# Altium schematic sheet Mobile_device_sheet4_sensor.SchDoc
size A4; SheetNumber: 3; SheetTotal: 5
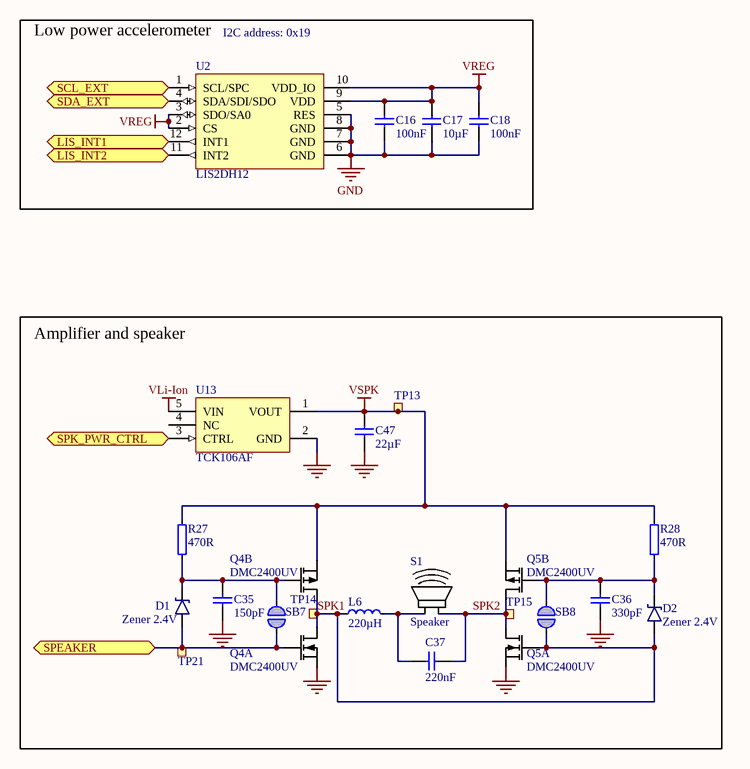
[diagram p0: Mobile_device_sheet4_sensor.SchDoc]

## Parts
C16  100nF  [CAPC1005X04L]
C17  10µF  [CAPC1608X06L]
C18  100nF  [CAPC1005X04L]
C35  150pF  [CAPC1005X04L]
C36  330pF  [CAPC1005X04L]
C37  220nF  [CAPC1005X04L]
C47  22µF  [CAPC1608X06L]
D1  Zener 2.4V  [SOD-523]
D2  Zener 2.4V  [SOD-523]
L6  220µH  [INDP4040X25N]
Q4  DMC2400UV  [SOTFL50P162X60-6N]  (parts A,B of 2)
Q5  DMC2400UV  [SOTFL50P162X60-6N]  (parts A,B of 2)
R27  470R  [RESC1005X04L]
R28  470R  [RESC1005X04L]
S1  Speaker  [Speaker 15x11x3mm]  (no BOM)
SB7  Solderbridge  [Solderbridge]  (value not drawn)  (no BOM)
SB8  Solderbridge  [Solderbridge]  (value not drawn)  (no BOM)
TP13  Ø1.5mm,SMD  [TP_SMD_Ø1.5mm]  (value not drawn)  (no BOM)
TP14  Ø1.5mm,SMD  [TP_SMD_Ø1.5mm]  (value not drawn)  (no BOM)
TP15  Ø1.5mm,SMD  [TP_SMD_Ø1.5mm]  (value not drawn)  (no BOM)
TP21  Ø1.5mm,SMD  [TP_SMD_Ø1.5mm]  (value not drawn)  (no BOM)
U2  LIS2DH12  [LGA50P200X200X100-12N]
U13  TCK106AF  [SOT95P280X140-5N]

## Blocks framed on the sheet
Low power accelerometer: C16-C18 U2
Amplifier and speaker: C35-C37 C47 D1 D2 L6 Q4 Q5 R27 R28 S1 SB7 SB8 TP13-TP15 TP21 U13

## Ports
LIS_INT1 (bidir), LIS_INT2 (bidir), SCL_EXT (bidir), SDA_EXT (bidir), SPEAKER (bidir), SPK_PWR_CTRL (bidir)

## Nets
GND: C16.1 C17.1 C18.1 C35.1 C36.1 C47.1 Q4.1(S1) Q5.1(S1) U2.5(RES) U2.6(GND) U2.7(GND) U2.8(GND) U13.2(GND)
VLi-Ion: U13.5(VIN)
VREG: C16.2 C17.2 C18.2 U2.2(CS) U2.3(SDO/SA0) U2.9(VDD) U2.10(VDD_IO)
VSPK: C47.2 Q4.4(S2) Q5.4(S2) R27.1 R28.1 TP13.1 U13.1(VOUT)
LIS_INT1: U2.12(INT1) ; port LIS_INT1
LIS_INT2: U2.11(INT2) ; port LIS_INT2
SCL_EXT: U2.1(SCL/SPC) ; port SCL_EXT
SDA_EXT: U2.4(SDA/SDI/SDO) ; port SDA_EXT
SPEAKER: D1.1(A) Q4.2(G1) SB7.2 TP21.1 ; port SPEAKER
SPK1: D2.1(A) L6.1 Q4.3(D2) Q4.6(D1) Q5.2(G1) SB8.2 TP14.1
SPK2: C37.1 Q5.3(D2) Q5.6(D1) S1.2 TP15.1
SPK_PWR_CTRL: U13.3(CTRL) ; port SPK_PWR_CTRL
NetC35_2: C35.2 D1.3(C) Q4.5(G2) R27.2 SB7.1
NetC36_2: C36.2 D2.3(C) Q5.5(G2) R28.2 SB8.1
NetC37_2: C37.2 L6.2 S1.1

Not connected (* = marked no-connect by the designer): U13 4(NC)

## Notes on the sheet
- (near U2) I2C address: 0x19

## Library data of the parts
C16 C18 = C0402-100n: Capacitor, X7R, ±10%; Part number IPS: 00000005296; Note: 16V; Artikkelnr Noca: 20039200; Part Number: C0402-100n; Manufacturer: *; Manufacturer Part Number: *; Footprint Doc: 0402; LatestRevisionDate: 2009-11-23; Pin Count: 2; Publisher: Nordic Semiconductor; Published: 2009-05-08; Value: 100nF; ComponentLink1URL: *; ComponentLink1Description: Datasheet; ComponentLink2URL: *; ComponentLink2Description: Supplier link; HelpURL: *; Supplier 1: *; Supplier Part Number 1: *; Supplier 2: *; Supplier Part Number 2: *
C17 = C0603-10µ: Capacitor, X5R, ±20%; Part number IPS: 00000007785; Note: 6.3V; Artikkelnr Noca: 20039234; Part Number: C0603-10µ; Manufacturer: *; Manufacturer Part Number: *; Footprint Doc: 0603; LatestRevisionDate: 2011-01-17; Pin Count: 2; Publisher: Nordic Semiconductor; Published: 2011-01-17; Value: 10µF; ComponentLink1URL: *; ComponentLink1Description: Datasheet; ComponentLink2URL: *; ComponentLink2Description: Supplier link; HelpURL: *; Supplier 1: *; Supplier Part Number 1: *; Supplier 2: *; Supplier Part Number 2: *
C35 = C0402-150p: Capacitor, NP0, ±5%; Part number IPS: 00000007972; Note: 50V; Artikkelnr Noca: 20029111; Part Number: C0402-150p; Manufacturer: *; Manufacturer Part Number: *; Footprint Doc: 0402; LatestRevisionDate: 2009-05-08; Pin Count: 2; Publisher: Nordic Semiconductor; Published: 2009-05-08; Value: 150pF; ComponentLink1URL: *; ComponentLink1Description: Datasheet; ComponentLink2URL: *; ComponentLink2Description: Supplier link; HelpURL: *; Supplier 1: *; Supplier Part Number 1: *; Supplier 2: *; Supplier Part Number 2: *
C36 = C0402-330p: Capacitor, NP0, ±5%; Part number IPS: 00000006576; Note: 50V; Artikkelnr Noca: N.A.; Part Number: C0402-330p; Manufacturer: *; Manufacturer Part Number: *; Footprint Doc: 0402; LatestRevisionDate: 2017-02-02; Pin Count: 2; Publisher: Nordic Semiconductor; Published: 2009-05-08; Value: 330pF; ComponentLink1URL: *; ComponentLink1Description: Datasheet; ComponentLink2URL: *; ComponentLink2Description: Supplier link; HelpURL: *; Supplier 1: *; Supplier Part Number 1: *; Supplier 2: *; Supplier Part Number 2: *
C37 = C0402-220n: Capacitor, X7R, ±10%; Part number IPS: 00000006793; Note: 16V; Artikkelnr Noca: N.A.; Part Number: C0402-220n; Manufacturer: *; Manufacturer Part Number: *; Footprint Doc: 0402; LatestRevisionDate: 2009-05-08; Pin Count: 2; Publisher: Nordic Semiconductor; Published: 2009-05-08; Value: 220nF; ComponentLink1URL: *; ComponentLink1Description: Datasheet; ComponentLink2URL: *; ComponentLink2Description: Supplier link; HelpURL: *; Supplier 1: *; Supplier Part Number 1: *; Supplier 2: *; Supplier Part Number 2: *
C47 = C0603-22µ-6.3V: CAP CER 22UF 6.3V 20% X5R 0603; Manufacturer: Samsung; Manufacturer Part Number: CL10A226MQ8NRNC; Part number IPS: 00000007787; Artikkelnr Noca: N.A.; Part Number: C0603-22µ-6.3V; Footprint Doc: 0603; LatestRevisionDate: 2015-04-10; Pin Count: 2; Publisher: Nordic Semiconductor; Published: 2015-04-10; Value: 22µF; Note: 6.3V; ComponentLink1URL: *; ComponentLink1Description: Datasheet; ComponentLink2URL: *; ComponentLink2Description: Supplier link; HelpURL: http://www.samsungsem.com/kr/front/downloadcms.do?path=/kr/support/product-search/mlcc/__icsFiles/afieldfile/2014/11/05&fileName=S_CL10A226MQ8NRNC.pdf; Supplier 1: Digi-Key; Supplier Part Number 1: 1276-1193-1-ND; Supplier 2: *; Supplier Part Number 2: *
D1 D2 = BZT52C2V4T: Diode, Zener, 2.4V, 0.3W; Manufacturer: Diodes Incorporated; Part number IPS: 00000007974; Artikkelnr Noca: N.A.; Part Number: BZT52C2V4T; Manufacturer Part Number: BZT52C2V4T; Footprint Doc: SOD-523; LatestRevisionDate: 2017-01-25; Publisher: Nordic Semiconductor; Published: 2017-01-25; Value: Zener 2.4V; Note: *; Pin Count: 2; ComponentLink1URL: *; ComponentLink1Description: Datasheet; ComponentLink2URL: *; ComponentLink2Description: Supplier link; HelpURL: http://www.diodes.com/_files/datasheets/ds30502.pdf; Supplier 1: Digi-Key; Supplier Part Number 1: BZT52C2V4T-7DICT-ND; Supplier 2: *; Supplier Part Number 2: *
L6 = L4040-220µ: Inductor, ±20%, 200mA, 2.76 Ohm; Manufacturer: Bourns; Manufacturer Part Number: SRN4026-221M; Part number IPS: 00000007797; Note: -40°C ~ 125°C; Artikkelnr Noca: N:A; Part Number: L4040-220µ; Footprint Doc: 4040; LatestRevisionDate: 2016-01-18; Pin Count: 2; Publisher: Nordic Semiconductor; Published: 2016-01-18; Value: 220µH; ComponentLink1Description: Datasheet; ComponentLink2Description: Supplier link; ComponentLink1URL: *; ComponentLink2URL: *; HelpURL: http://www.bourns.com/docs/Product-Datasheets/SRN4026.pdf; Supplier 1: Digi-Key; Supplier Part Number 1: SRN4026-221MCT-ND; Supplier 2: *; Supplier Part Number 2: *
Q4 Q5 = DMC2400UV: Dual N & P Ch MOFET, 1.03A/0.7A, 480mOhm, 450mW; Manufacturer: Diodes Incorporated; Part number IPS: 00000007803; Note: Dual N & P Channel Digital FET; Artikkelnr Noca: N.A.; Part Number: DMC2400UV; Manufacturer Part Number: DMC2400UV; Footprint Doc: SOT-563; LatestRevisionDate: 2016-01-18; Pin Count: 6; Publisher: Nordic Semiconductor; Published: 2016-01-18; Value: DMC2400UV; ComponentLink1URL: *; ComponentLink1Description: Datasheet; ComponentLink2URL: *; ComponentLink2Description: Supplier link; HelpURL: http://www.diodes.com/_files/datasheets/DMC2400UV.pdf; Supplier 1: Digi-Key; Supplier Part Number 1: DMC2400UV-7DICT-ND; Supplier 2: *; Supplier Part Number 2: *
R27 R28 = R0402-470: Resistor, ±1%, 0.063W; Part number IPS: 00000007975; Note: Chip Res 1%; Artikkelnr Noca: 27049065; Part Number: R0402-470; Manufacturer: *; Manufacturer Part Number: *; LatestRevisionDate: 2009-11-23; Pin Count: 2; Publisher: Nordic Semiconductor; Published: 2009-05-08; Value: 470R; Footprint Doc: 0402; ComponentLink1URL: *; ComponentLink1Description: Datasheet; ComponentLink2URL: *; ComponentLink2Description: Supplier link; HelpURL: *; Supplier 1: Farnell; Supplier Part Number 1: 173-8845; Supplier 2: *; Supplier Part Number 2: *
S1 = BMS1511F-11C-08H03P LF: Speaker, SMD, 15.0mm x 11.0mm x 3.0mm, 0Hz-20kHz, 89dB, 8 ohm, 0.7W; Manufacturer: BeStar; Artikkelnr Noca: N.A.; Part Number: BMS1511F-11C-08H03P LF; Manufacturer Part Number: BMS1511F-11C-08H03P LF; Footprint Doc: Speaker 15x11x3mm; LatestRevisionDate: 2016-09-15; Pin Count: 2; Publisher: Nordic Semiconductor; Published: 2016-09-15; Value: Speaker; Note: *; Part number IPS: N.A.; ComponentLink1URL: *; ComponentLink1Description: Datasheet; ComponentLink2URL: *; ComponentLink2Description: Supplier link; HelpURL: \\hizz\pro\app9717\Datasheet\speakers\bestar\BMS1511F-11C-08H03P LF.pdf; Supplier 1: *; Supplier Part Number 1: *; Supplier 2: *; Supplier Part Number 2: *
SB7 SB8 = Solderbridge: Artikkelnr Noca: N.A.; Part Number: Solderbridge; Manufacturer: *; Manufacturer Part Number: *; Footprint Doc: Solderbridge; LatestRevisionDate: 2009-12-14; Pin Count: 2; Publisher: Nordic Semiconductor; Published: 2009-12-14; Value: Solderbridge; Note: *; Part number IPS: N.A.; ComponentLink1URL: *; ComponentLink1Description: Datasheet; ComponentLink2URL: *; ComponentLink2Description: Supplier link; HelpURL: *; Supplier 1: *; Supplier Part Number 1: *; Supplier 2: *; Supplier Part Number 2: *
TP13-TP15 TP21 = TP_SMD_Ø1.5MM: 1.0mm circular SMD testpad; Manufacturer: Nordic Semiconductor; Artikkelnr Noca: N.A.; Part Number: TP_SMD_Ø1.5MM; Manufacturer Part Number: *; Footprint Doc: TP_SMD_Ø1.5mm; LatestRevisionDate: 2016-06-02; Pin Count: 1; Publisher: Nordic Semiconductor; Published: 2016-06-02; Value: Ø1.5mm,SMD; Note: *; Part number IPS: N.A.; ComponentLink1URL: *; ComponentLink1Description: Datasheet; ComponentLink2URL: *; ComponentLink2Description: Supplier link; HelpURL: *; Supplier 1: *; Supplier Part Number 1: *; Supplier 2: *; Supplier Part Number 2: *
U2 = LIS2DH12: 3-axis - ±2g/±4g/±8g/±16g digital output femto accelerometer; Manufacturer: STMicroelectronics; Part number IPS: 00000007817; Note: MEMS digital output motion sensor ultra low-power high performance 3-axes "femto" accelerometer; Artikkelnr Noca: N.A.; Part Number: LIS2DH12; Manufacturer Part Number: LIS2DH12; Footprint Doc: LGA-12; LatestRevisionDate: 2015-09-29; Pin Count: 12; Publisher: Nordic Semiconductor; Published: 2015-09-29; Value: LIS2DH12; ComponentLink1URL: *; ComponentLink1Description: Datasheet; ComponentLink2URL: *; ComponentLink2Description: Supplier link; HelpURL: http://www.st.com/st-web-ui/static/active/en/resource/technical/document/datasheet/DM00091513.pdf; Supplier 1: Digi-Key; Supplier Part Number 1: 497-14851-1-ND; Supplier 2: Farnell; Supplier Part Number 2: 243-3081
U13 = TCK106AF,LF: 1.0 A Load Switch IC with Slew Rate Control Driver in Small Package; Manufacturer: Toshiba; Part number IPS: 00000007823; Artikkelnr Noca: 15070086; Part Number: TCK106AF,LF; Manufacturer Part Number: TCK106AF,LF; Footprint Doc: SOT-25; LatestRevisionDate: 2016-09-29; Pin Count: 5; Publisher: Nordic Semiconductor; Published: 2016-09-29; Value: TCK106AF; Note: *; Supplier 1: Digi-Key; Supplier Part Number 1: TCK106AFLFCT-ND; Supplier 2: *; Supplier Part Number 2: *; ComponentLink1URL: *; ComponentLink1Description: Datasheet; ComponentLink2URL: *; ComponentLink2Description: Supplier link; HelpURL: https://toshiba.semicon-storage.com/info/docget.jsp?did=53240&prodName=TCK108AF